# EAGLE design 219_9axis (EAGLE 9.6.2)
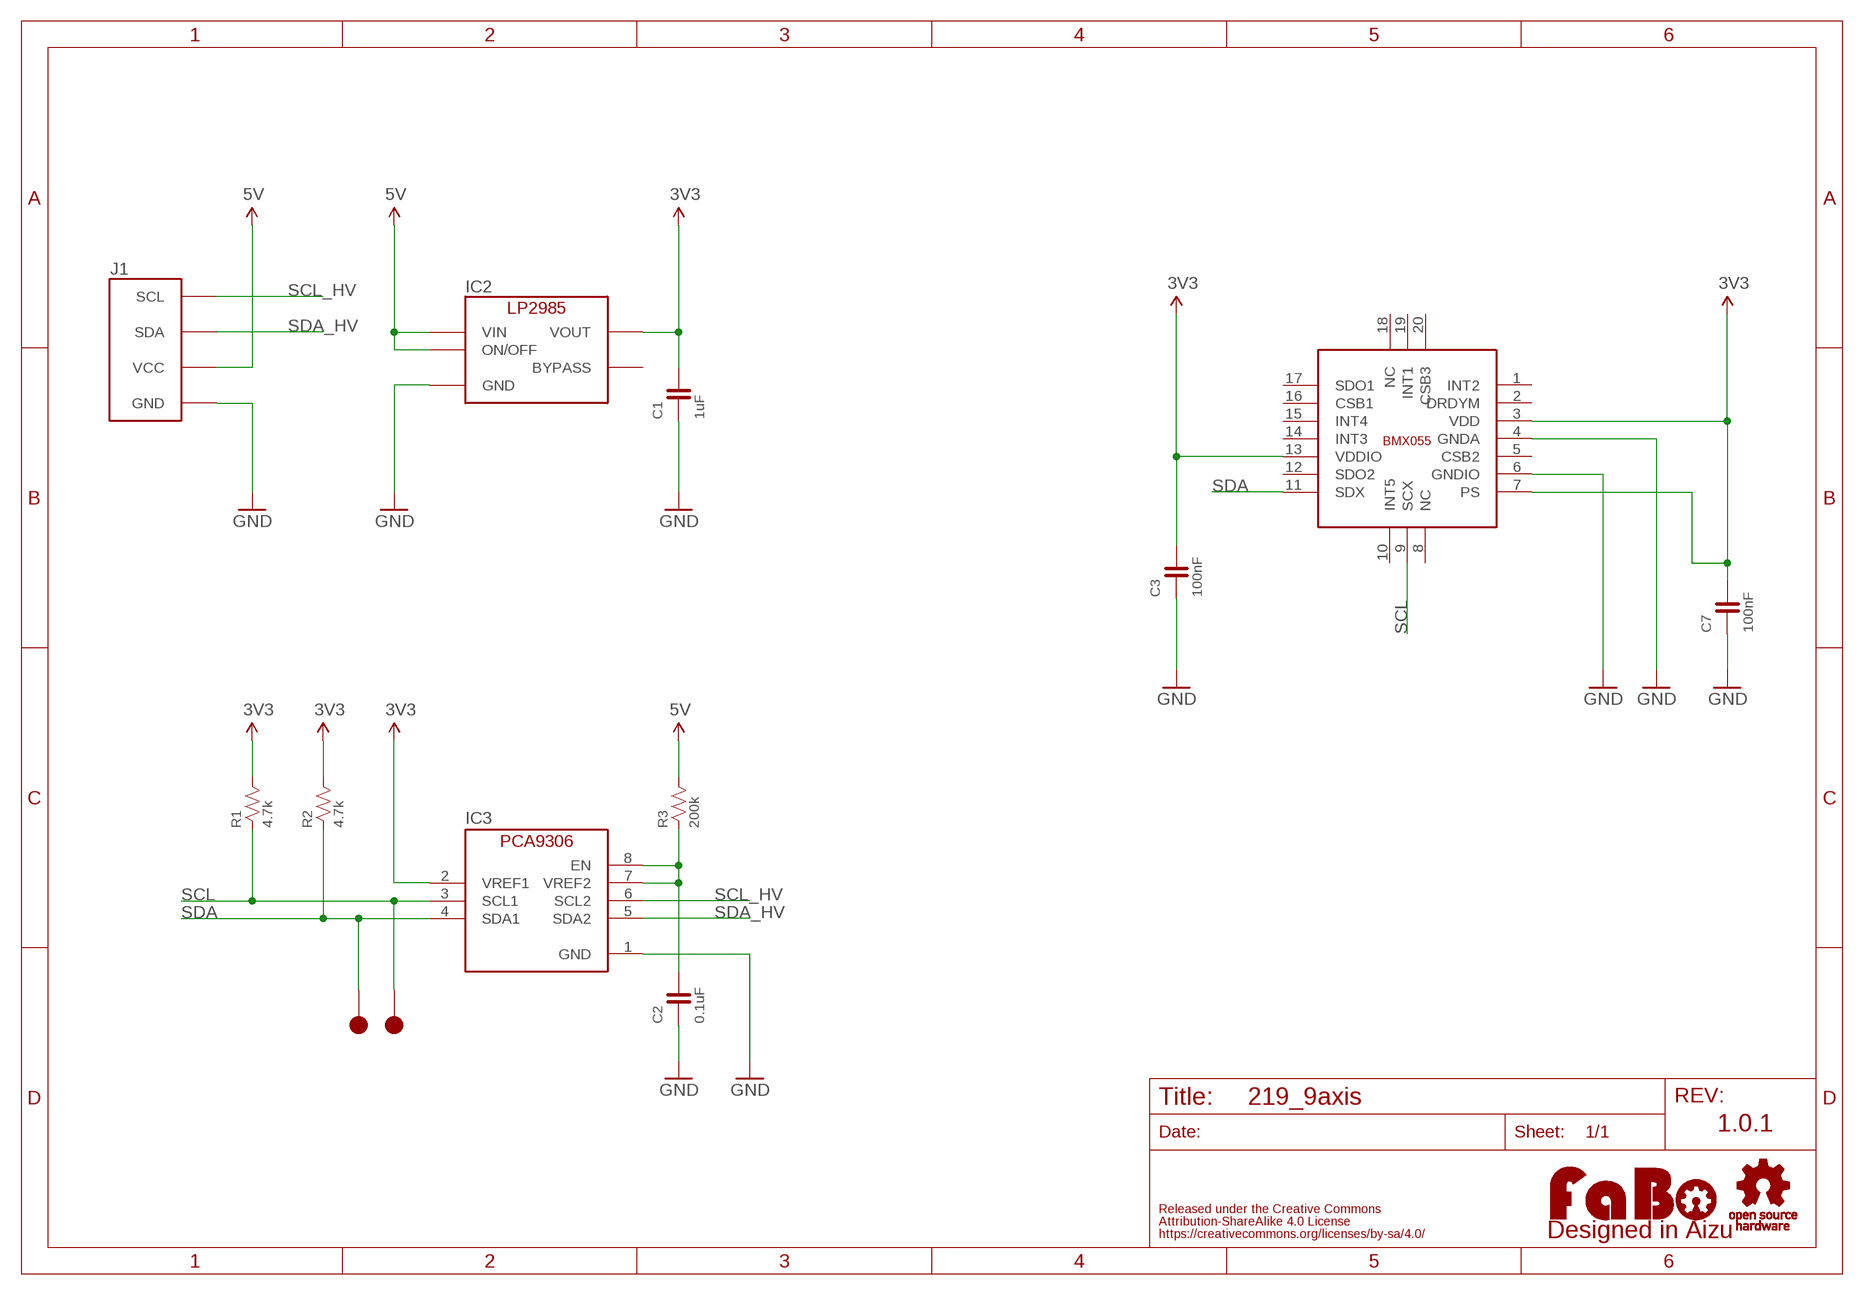
[diagram p0: schematic, sheet 1]

## Parts
BMX055  BO-BMX055  [BOSCH-BMX055]
C1  1uF  CAPACITOR-0603  [0603]
C2  0.1uF  CAPACITOR-0603  [0603]
C3  100nF  CAPACITOR-0603  [0603]
C7  100nF  CAPACITOR-0603  [0603]
IC2  LP2985-33DBV  [SOT-23-5]
IC3  PCA9306GM  [XQFN8]
J1  FABO_BRICK_I2C  [FABO_BRICK_I2C]
LOGO1  LOGO_FABO-M  [LOGO_FABO_M]
R1  4.7k  RESISTOR-0603  [0603]
R2  4.7k  RESISTOR-0603  [0603]
R3  200k  RESISTOR-0603  [0603]
TP1  TP-15  [TP-15]
TP2  TP-15  [TP-15]
U$2  LOGO_OSHW-M_BOTTOM  [LOGO_OSHW_M_BOTTOM]

## Nets
3V3: BMX055.3(VDD) BMX055.7(PS) BMX055.13(VDDIO) C1.2 C3.2 C7.2 IC2.5(VOUT) IC3.2(VREF1) R1.2 R2.2
5V: IC2.1(VIN) IC2.3(ON/OFF) J1.VCC R3.2
GND: BMX055.4(GNDA) BMX055.6(GNDIO) C1.1 C2.1 C3.1 C7.1 IC2.2(GND) IC3.1(GND) J1.GND
N$1: C2.2 IC3.7(VREF2) IC3.8(EN) R3.1
SCL: BMX055.9(SCX) IC3.3(SCL1) R1.1 TP2.1
SCL_HV: IC3.6(SCL2) J1.SCL
SDA: BMX055.11(SDX) IC3.4(SDA1) R2.1 TP1.1
SDA_HV: IC3.5(SDA2) J1.SDA
Unconnected: BMX055.1(INT2) BMX055.2(DRDYM) BMX055.5(CSB2) BMX055.8(NC) BMX055.10(INT5) BMX055.12(SDO2) BMX055.14(INT3) BMX055.15(INT4) BMX055.16(CSB1) BMX055.17(SDO1) BMX055.18(NC) BMX055.19(INT1) BMX055.20(CSB3) IC2.4(BYPASS)

## Notes on the sheet
- 1.0.1

## Library data of the parts
BMX055 = FaBo-Mems:BO-BMX055
C1-C3 C7 = FaBo-Capacitor:CAPACITOR: CAPACITOR
IC2 = FaBo-Supply:LP2985: LP2985
IC3 = FaBo-LevelTranslator:PCA9306
J1 = FaBo-Template:FABO_BRICK_I2C: FaBo Brick I2C
LOGO1 = component:LOGO_FABO
R1-R3 = FaBo-Resistors:RESISTOR: RESISTOR
TP1 TP2 = FaBo-Supply:TP
U$2 = FaBo-etc:LOGO_OSHW

## Board
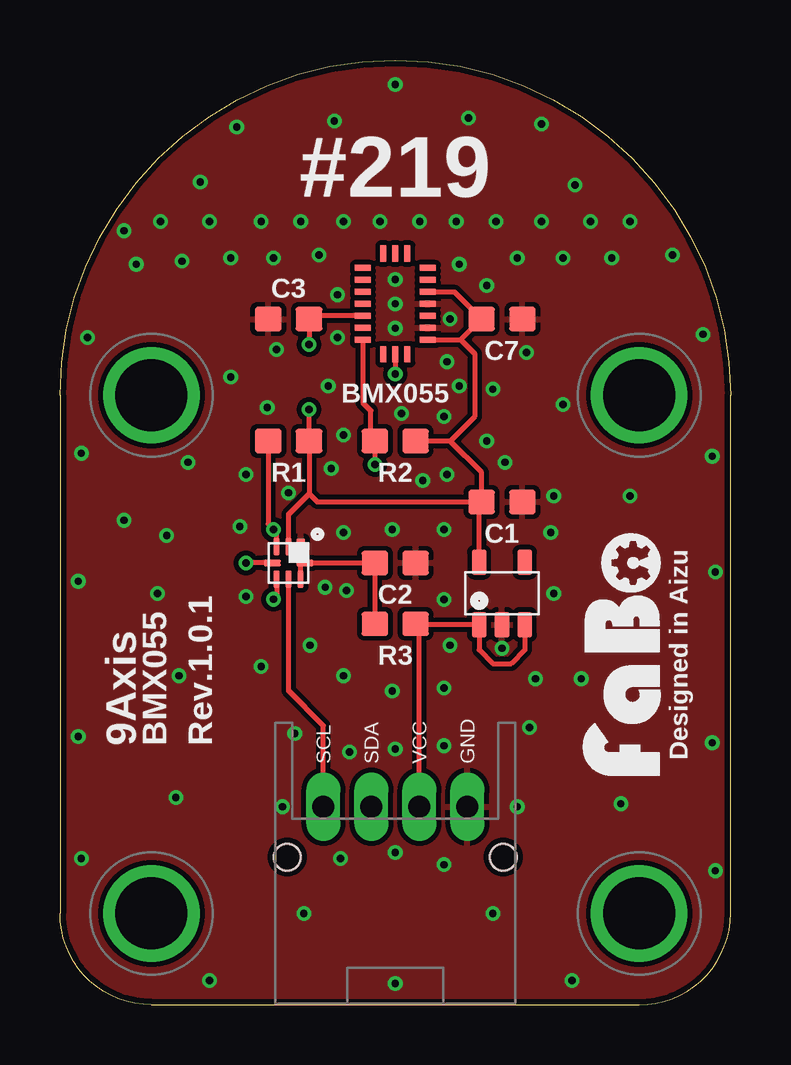
[diagram p1: board, top side]
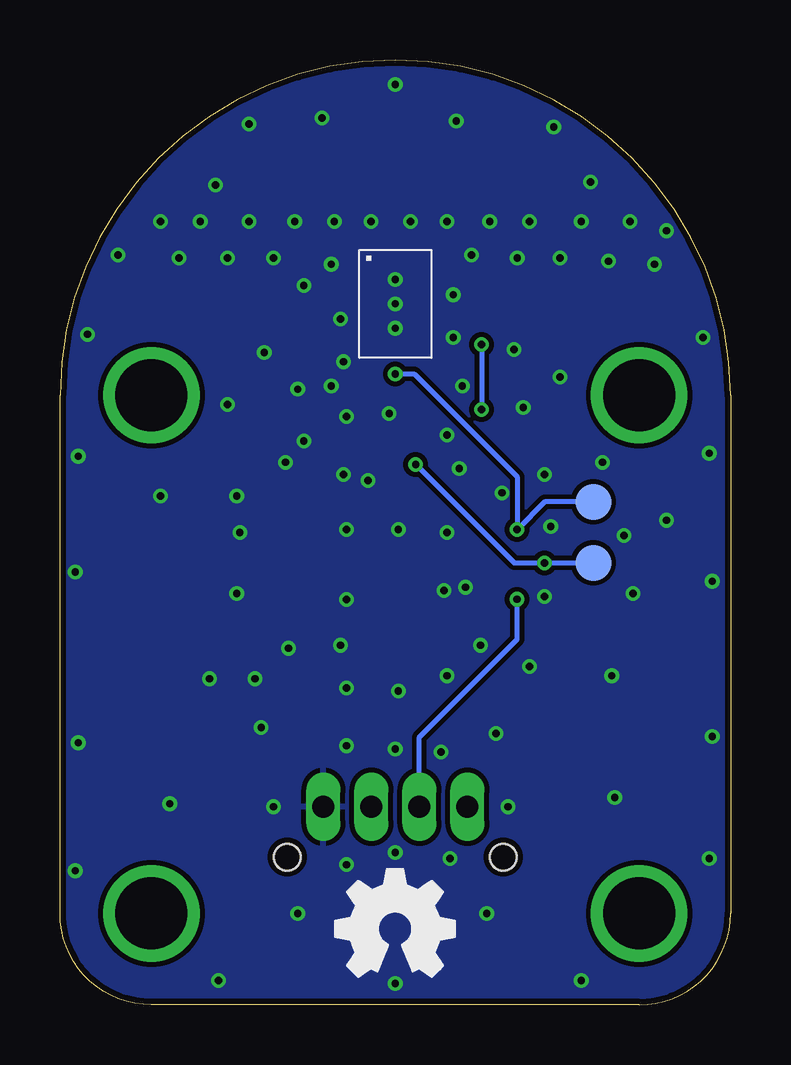
[diagram p2: board, bottom side, seen from below]

Size 27.94 x 39.37 mm. Coordinates in mm from the lower left corner, seen from the top.
Copper layers (1*16): Top 0.035mm / dielectric 1.6mm / Bottom 0.035mm
Design rules "PCBway": minimum track width 6mil, minimum drill 12mil, track to track 6mil, track to pad 6mil, pad to pad 6mil, via to via 6mil, smd to smd 6mil, copper to edge 10mil, drill to drill 10mil, minimum pad ring 10mil, minimum via ring 6mil, stop-mask expansion 2mil, vias tented up to drill 100mil, thermal gap 8mil

### Footprints (pad centres in the part's own frame; a part is rotated, then mirrored left to right if it is on the bottom)
BOSCH-BMX055 = smd 0.675 x 0.25: 1 1.35,1.5; 2 1.35,1; 3 1.35,0.5; 4 1.35,0; 5 1.35,-0.5; 6 1.35,-1; 7 1.35,-1.5; 11 -1.35,-1.5; 12 -1.35,-1; 13 -1.35,-0.5; 14 -1.35,0; 15 -1.35,0.5; 16 -1.35,1; 17 -1.35,1.5 | smd 0.25 x 0.675: 8 0.5,-2.1; 9 0,-2.1; 10 -0.5,-2.1; 18 -0.5,2.1; 19 0,2.1; 20 0.5,2.1
0603 = smd 1.1 x 1: 1 -0.85,0; 2 0.85,0
SOT-23-5 = smd 0.6 x 1.05: 1 -0.95,-1.3; 2 0,-1.3; 3 0.95,-1.3; 4 0.95,1.3; 5 -0.95,1.3
XQFN8 = smd 0.7 x 0.35: 1 -0.675,0.5 | smd 0.7 x 0.25: 2 -0.675,0; 3 -0.675,-0.5; 5 0.675,-0.5; 6 0.675,0; 7 0.675,0.5 | smd 0.25 x 0.7: 4 0,-0.675; 8 0,0.675
FABO_BRICK_I2C = drill 0.9 pad 1.422 long: GND 3,-10.795; SCL -3,-10.795; SDA -1,-10.795; VCC 1,-10.795 | drill 3 pad 3.81: P$1 -10.16,6.35; P$2 10.16,6.35; P$3 -10.16,-15.24; P$4 10.16,-15.24 | hole 1.1: -4.5,-12.895; 4.5,-12.895
TP-15 = smd 1.5 x 1.5: 1 0,0

### Placement (x,y rotation side)
BMX055  13.97,29.21 0 top
C1  18.41,20.95 180 top
C2  13.97,18.41 180 top
C3  9.53,28.57 0 top
C7  18.41,28.57 180 top
IC2  18.41,17.14 0 top
IC3  9.53,18.41 270 top
J1  13.97,19.05 0 top
LOGO1  25.4,14.61 90 top
R1  9.53,23.5 0 top
R2  13.97,23.5 0 top
R3  13.97,15.88 0 top
TP1  5.71,18.41 0 bottom
TP2  5.71,20.95 0 bottom
U$2  13.97,3.17 0 top

### Tracks (layer width: path | path; a pad name or v marks a point on that pad's centre or on a via)
3V3  (via drill 0.3)
  Top 0.203: IC2.5 17.46,20.86 C1.2 | 16.26,23.5 R2.2 | C1.2 17.57,22.19 16.26,23.5 | BMX055.3 16.43,29.71 C7.2 16.7,27.71 | BMX055.7 16.7,27.71 | 16.7,27.71 17.27,27.14 17.27,24.51 16.26,23.5 | BMX055.13 10.51,28.71 C3.2 v10.38,27.52 | IC3.2 9.53,20.45 10.38,21.3 | 10.38,21.3 R1.2 v10.38,24.8 | 10.38,21.3 10.72,20.95 C1.2
  Bottom 0.203: v10.38,27.52 v10.38,24.8
5V
  Top 0.203: J1.VCC 14.97,15.72 R3.2 14.85,15.85 IC2.1 17.46,14.79 18.03,14.22 18.8,14.22 19.36,14.79 IC2.3
GND  (via drill 0.3)
  other vias: 18.41,14.86 16.26,28.57 13.97,29.21 13.97,30.23 13.97,28.19 9.53,21.34 16.26,14.99 16,16.89 16,19.81 13.84,19.81 11.81,19.68 16.13,22.1 15.11,21.84 11.3,22.35 7.75,22.1 7.49,19.94 7.75,17.02 8.38,14.1 10.41,14.99 11.05,17.4 11.94,17.27 11.81,13.72 9.78,11.3 12.06,10.54 13.97,10.67 16,10.79 13.84,13.08 16,13.21 19.81,13.59 20.57,17.14 20.45,19.68 20.57,21.21 18.54,22.61 17.78,23.5 18.03,25.65 16.64,25.78 16.13,26.8 19.43,27.18 16,24.51 14.22,24.64 11.81,23.75 11.18,25.78 11.56,27.81 11.56,29.59 9.02,27.3 8.64,24.89 17.78,29.97 16.64,30.86 16.51,32.64 14.99,32.64 13.34,32.64 11.81,32.64 10.03,32.64 8.38,32.64 18.16,32.64 20.07,32.64 22.1,32.64 23.75,32.64 25.53,31.24 22.99,31.11 20.95,31.11 19.05,31.11 10.79,31.24 8.89,31.11 7.11,31.11 6.22,32.64 5.08,30.99 4.19,32.64 3.17,30.86 2.67,32.26 1.14,27.81 26.8,27.94 20.95,25.02 7.11,26.16 27.18,22.86 0.89,22.99 4.45,19.56 5.33,22.61 4.06,17.14 23.75,21.21 27.3,18.03 0.76,17.65 2.67,20.19 0.76,11.18 4.95,13.72 27.18,10.92 21.72,13.59 11.68,6.1 13.97,6.35 16,5.84 19.05,8.26 19.56,11.56 9.27,8.26 0.89,6.1 27.3,5.59 23.37,8.38 4.83,8.64 6.22,1.02 21.34,1.02 13.97,0.89 10.16,3.81 18.03,3.81 13.97,38.35 20.07,36.7 7.37,36.58 5.84,34.29 21.46,34.16 11.43,36.83 17.02,36.96
  pour Top (isolate 0.203): 0,0 27.94,0 27.94,39.37 0,39.37
  pour Bottom (isolate 0.203): 0,0 27.94,0 27.94,39.37 0,39.37
N$1
  Top 0.203: R3.1 C2.2 IC3.8 10.03,18.41 IC3.7
SCL  (via drill 0.3)
  Top 0.203: IC3.3 9.03,19.68 v8.9,19.8 8.68,20.03 R1.1 | BMX055.9 v13.97,26.29
  Bottom 0.203: TP2.1 7.75,20.95 v8.9,19.8 8.9,22.01 13.18,26.29 v13.97,26.29
SCL_HV
  Top 0.203: IC3.6 9.53,13.08 10.97,11.64 J1.SCL
SDA  (via drill 0.3)
  Top 0.203: IC3.4 v7.75,18.41 | BMX055.11 12.62,25.1 12.95,24.77 12.95,23.66 R2.1 v13.12,22.52
  Bottom 0.203: TP1.1 v7.75,18.41 9.02,18.41 v13.12,22.52
SDA_HV  (via drill 0.3)
  Top 0.203: IC3.5 9.03,17.03 v8.9,16.9
  Bottom 0.203: v8.9,16.9 8.9,15.23 12.97,11.16 J1.SDA

### Text on the board
tPlace: #219 | Designed in Aizu | 9Axis | BMX055 | Rev.1.0.1